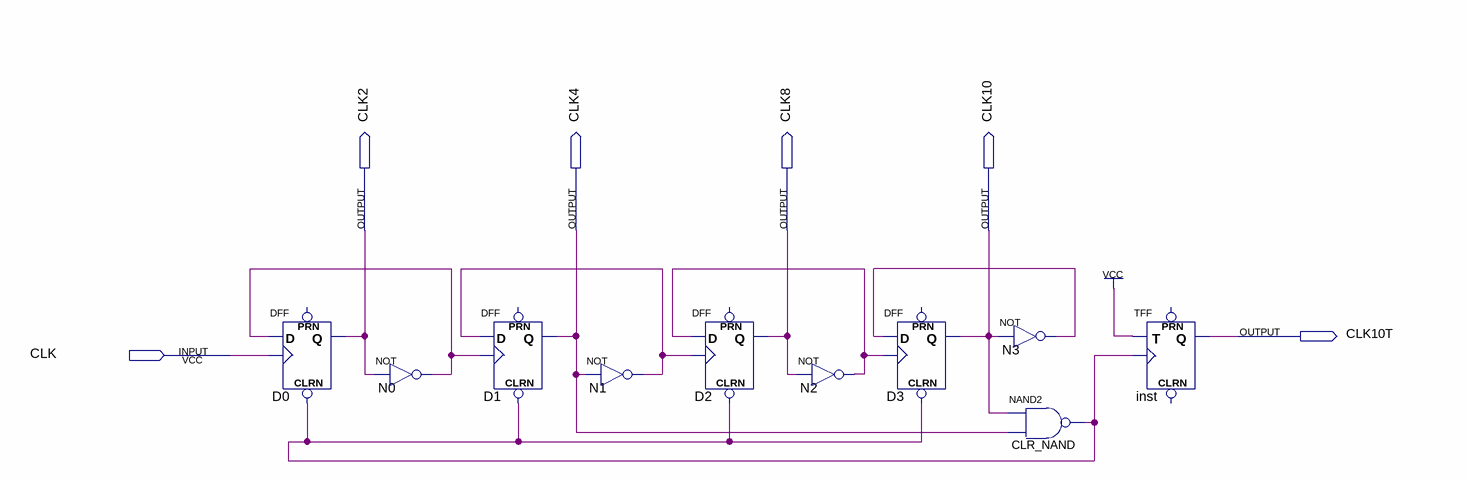
[diagram p0: schematic sheet]
// Quartus schematic Old_T10.bdf as structural Verilog: 10 symbols, 6 pins
module Old_T10 (
  input  CLK,
  output CLK2,
  output CLK4,
  output CLK8,
  output CLK10,
  output CLK10T
);

  wire CLR_NAND_out, N0_out, N1_out, N2_out, N3_out;

  DFF D0 (.CLRN(CLR_NAND_out), .CLK(CLK), .D(N0_out), .Q(CLK2));  // open: PRN
  not N0 (N0_out, CLK2);
  DFF D1 (.CLRN(CLR_NAND_out), .CLK(N0_out), .D(N1_out), .Q(CLK4));  // open: PRN
  not N1 (N1_out, CLK4);
  DFF D2 (.CLRN(CLR_NAND_out), .CLK(N1_out), .D(N2_out), .Q(CLK8));  // open: PRN
  not N2 (N2_out, CLK8);
  DFF D3 (.CLRN(CLR_NAND_out), .CLK(N2_out), .D(N3_out), .Q(CLK10));  // open: PRN
  not N3 (N3_out, CLK10);
  nand CLR_NAND (CLR_NAND_out, CLK10, CLK4);
  TFF inst (.T(1'b1), .CLK(CLR_NAND_out), .Q(CLK10T));  // open: PRN, CLRN
endmodule
